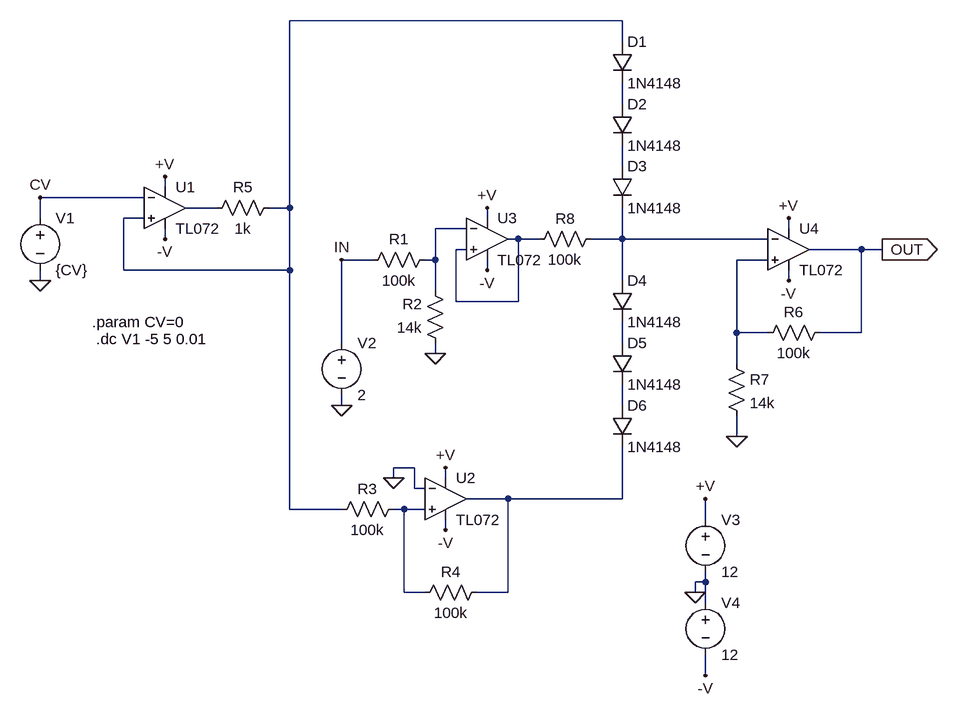
[diagram p0: schematic 2023-01-04 Diode VCO.asc]
2023-01-04 Diode VCO.asc, the LTspice schematic file:
Version 4
SHEET 1 1372 908
WIRE 864 -192 352 -192
WIRE 864 -160 864 -192
WIRE 864 -64 864 -96
WIRE 864 32 864 0
WIRE 160 64 160 48
WIRE 128 80 -32 80
WIRE 240 96 192 96
WIRE 352 96 352 -192
WIRE 352 96 320 96
WIRE -32 112 -32 80
WIRE 128 112 96 112
WIRE 656 112 656 96
WIRE 624 128 576 128
WIRE 1120 128 1120 112
WIRE 160 144 160 128
WIRE 704 144 688 144
WIRE 736 144 704 144
WIRE 864 144 864 96
WIRE 864 144 816 144
WIRE 1088 144 864 144
WIRE 624 160 608 160
WIRE 1232 160 1152 160
WIRE 1264 160 1232 160
WIRE 480 176 432 176
WIRE 576 176 576 128
WIRE 576 176 560 176
WIRE 1088 176 1040 176
WIRE 96 192 96 112
WIRE 352 192 352 96
WIRE 352 192 96 192
WIRE 656 192 656 176
WIRE -32 208 -32 192
WIRE 864 208 864 144
WIRE 1120 208 1120 192
WIRE 576 224 576 176
WIRE 608 240 608 160
WIRE 704 240 704 144
WIRE 704 240 608 240
WIRE 1040 288 1040 176
WIRE 1088 288 1040 288
WIRE 1232 288 1232 160
WIRE 1232 288 1168 288
WIRE 432 304 432 176
WIRE 864 304 864 272
WIRE 576 320 576 304
WIRE 1040 336 1040 288
WIRE 432 400 432 384
WIRE 864 400 864 368
WIRE 1040 448 1040 416
WIRE 544 496 512 496
WIRE 512 512 512 496
WIRE 592 512 592 496
WIRE 544 528 544 496
WIRE 560 528 544 528
WIRE 688 544 624 544
WIRE 864 544 864 464
WIRE 864 544 688 544
WIRE 352 560 352 192
WIRE 432 560 352 560
WIRE 528 560 512 560
WIRE 560 560 528 560
WIRE 992 576 992 544
WIRE 592 592 592 576
WIRE 992 672 992 656
WIRE 992 672 976 672
WIRE 528 688 528 560
WIRE 560 688 528 688
WIRE 688 688 688 544
WIRE 688 688 640 688
WIRE 976 688 976 672
WIRE 992 704 992 672
WIRE 992 816 992 784
FLAG 976 688 0
FLAG 992 816 -V
FLAG 992 544 +V
FLAG -32 208 0
FLAG 432 400 0
FLAG 592 496 +V
FLAG 592 592 -V
FLAG 160 48 +V
FLAG 160 144 -V
FLAG 656 96 +V
FLAG 656 192 -V
FLAG 1120 112 +V
FLAG 1120 208 -V
FLAG 576 320 0
FLAG 1040 448 0
FLAG 512 512 0
FLAG 1264 160 OUT
IOPIN 1264 160 Out
FLAG 432 176 IN
FLAG -32 80 CV
SYMBOL AutoGenerated\\TL072 160 96 R0
SYMATTR InstName U1
SYMBOL AutoGenerated\\TL072 592 544 R0
SYMATTR InstName U2
SYMBOL AutoGenerated\\TL072 656 144 R0
SYMATTR InstName U3
SYMBOL AutoGenerated\\TL072 1120 160 R0
SYMATTR InstName U4
SYMBOL voltage -32 96 R0
WINDOW 123 0 0 Left 0
WINDOW 39 0 0 Left 0
SYMATTR InstName V1
SYMATTR Value {CV}
SYMBOL voltage 432 288 R0
WINDOW 123 0 0 Left 0
WINDOW 39 0 0 Left 0
SYMATTR InstName V2
SYMATTR Value 2
SYMBOL voltage 992 560 R0
WINDOW 123 0 0 Left 0
WINDOW 39 0 0 Left 0
SYMATTR InstName V3
SYMATTR Value 12
SYMBOL voltage 992 688 R0
WINDOW 123 0 0 Left 0
WINDOW 39 0 0 Left 0
SYMATTR InstName V4
SYMATTR Value 12
SYMBOL res 576 160 R90
WINDOW 0 0 56 VBottom 2
WINDOW 3 32 56 VTop 2
SYMATTR InstName R1
SYMATTR Value 100k
SYMBOL res 592 320 R180
WINDOW 0 36 76 Left 2
WINDOW 3 36 40 Left 2
SYMATTR InstName R2
SYMATTR Value 14k
SYMBOL res 416 576 R270
WINDOW 0 32 56 VTop 2
WINDOW 3 0 56 VBottom 2
SYMATTR InstName R3
SYMATTR Value 100k
SYMBOL res 544 704 R270
WINDOW 0 32 56 VTop 2
WINDOW 3 0 56 VBottom 2
SYMATTR InstName R4
SYMATTR Value 100k
SYMBOL res 224 112 R270
WINDOW 0 32 56 VTop 2
WINDOW 3 0 56 VBottom 2
SYMATTR InstName R5
SYMATTR Value 1k
SYMBOL res 1072 304 R270
WINDOW 0 32 56 VTop 2
WINDOW 3 0 56 VBottom 2
SYMATTR InstName R6
SYMATTR Value 100k
SYMBOL res 1024 320 R0
SYMATTR InstName R7
SYMATTR Value 14k
SYMBOL diode 848 -160 R0
SYMATTR InstName D1
SYMATTR Value 1N4148
SYMBOL diode 848 -64 R0
SYMATTR InstName D2
SYMATTR Value 1N4148
SYMBOL diode 848 32 R0
SYMATTR InstName D3
SYMATTR Value 1N4148
SYMBOL res 832 128 R90
WINDOW 0 0 56 VBottom 2
WINDOW 3 32 56 VTop 2
SYMATTR InstName R8
SYMATTR Value 100k
SYMBOL diode 848 208 R0
SYMATTR InstName D4
SYMATTR Value 1N4148
SYMBOL diode 848 304 R0
SYMATTR InstName D5
SYMATTR Value 1N4148
SYMBOL diode 848 400 R0
SYMATTR InstName D6
SYMATTR Value 1N4148
TEXT 48 272 Left 2 !.param CV=0
TEXT 54 298 Left 2 !.dc V1 -5 5 0.01

The netlist it stands for:
* 2023-01-04 Diode VCO.asc
* U1: TL072 (symbol AutoGenerated\TL072 not available, pins judged from their places): In+=N001 In-=CV V+=+V V-=-V OUT=N004
* U2: TL072 (symbol AutoGenerated\TL072 not available, pins judged from their places): In+=N012 In-=0 V+=+V V-=-V OUT=N011
* U3: TL072 (symbol AutoGenerated\TL072 not available, pins judged from their places): In+=N006 In-=N005 V+=+V V-=-V OUT=N006
* U4: TL072 (symbol AutoGenerated\TL072 not available, pins judged from their places): In+=N008 In-=N007 V+=+V V-=-V OUT=OUT
V1 CV 0 {CV}
V2 IN 0 2
V3 +V 0 12
V4 0 -V 12
R1 N005 IN 100k
R2 0 N005 14k
R3 N001 N012 100k
R4 N012 N011 100k
R5 N004 N001 1k
R6 N008 OUT 100k
R7 N008 0 14k
D1 N001 N002 1N4148
D2 N002 N003 1N4148
D3 N003 N007 1N4148
R8 N007 N006 100k
D4 N007 N009 1N4148
D5 N009 N010 1N4148
D6 N010 N011 1N4148
.model D D
.lib standard.dio
.param CV=0
.dc V1 -5 5 0.01
.backanno
.end